# EAGLE design sensor (EAGLE 6.5.0)
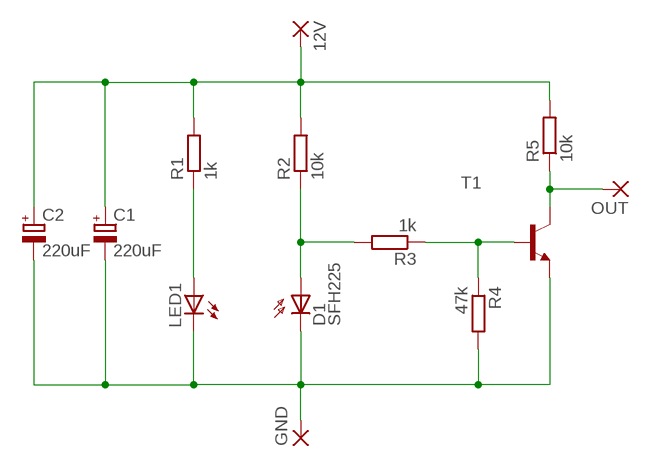
[diagram p0: schematic, sheet 1]

## Parts
12V  SMD2  [SMD1,27-2,54]
C1  220uF  CPOL-EUE5-6  [E5-6]
C2  220uF  CPOL-EUE5-6  [E5-6]
D1  SFH225  [SFH225]
GND  SMD2  [SMD1,27-2,54]
LED1  LED3MM  [LED3MM]
OUT  SMD2  [SMD1,27-2,54]
R1  1k  R-EU_M0805  [M0805]
R2  10k  R-EU_M0805  [M0805]
R3  1k  R-EU_M0805  [M0805]
R4  47k  R-EU_M0805  [M0805]
R5  10k  R-EU_M0805  [M0805]
T1  -NPN-SOT23-EBC  [SOT23-EBC]

## Nets
N$1: C1.- C2.- D1.K(C) GND.1(P) LED1.K(C) R4.2 T1.E
N$2: D1.A R2.1 R3.2
N$3: LED1.A R1.1
N$4: 12V.1(P) C1.+ C2.+ R1.2 R2.2 R5.2
N$6: R3.1 R4.1 T1.B
N$30: OUT.1(P) R5.1 T1.C

## Library data of the parts
12V GND OUT = wirepad:SMD2: SMD PAD
C1 C2 = resistor:CPOL-EU: POLARIZED CAPACITOR, European symbol
D1 = opto-trans-siemens:SFH225: PHOTO DIODE; OC_FARNELL: unknown; OC_NEWARK: unknown
LED1 = sparkfun-LED:LED: LEDs Standard schematic elements and footprints for 5mm, 3mm, 1206, and 0603 sized LEDs. 5mm - Spark Fun Electronics SKU : COM-00529 (and others)
R1-R5 = rcl:R-EU_: RESISTOR, European symbol
T1 = transistor:*-NPN-: NPN Transistror BF959 corrected 2008.03.06

## Board
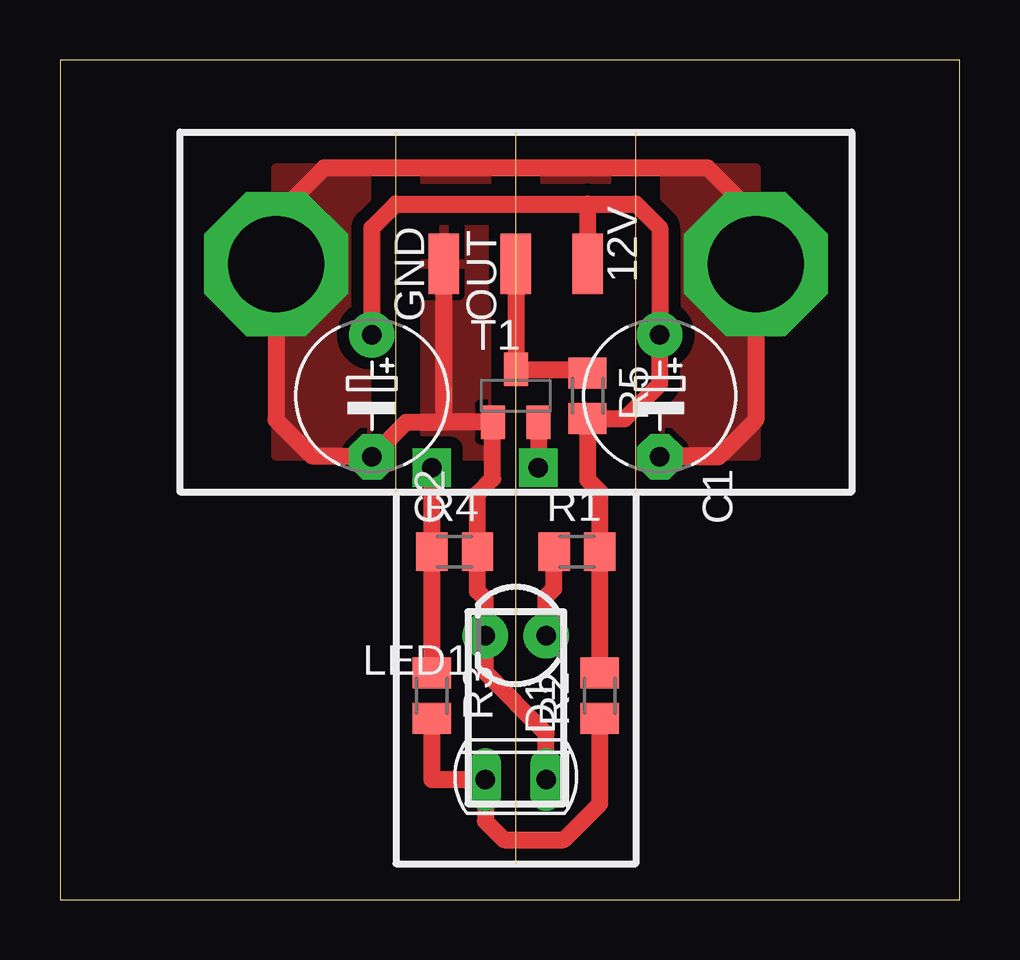
[diagram p1: board, top side]
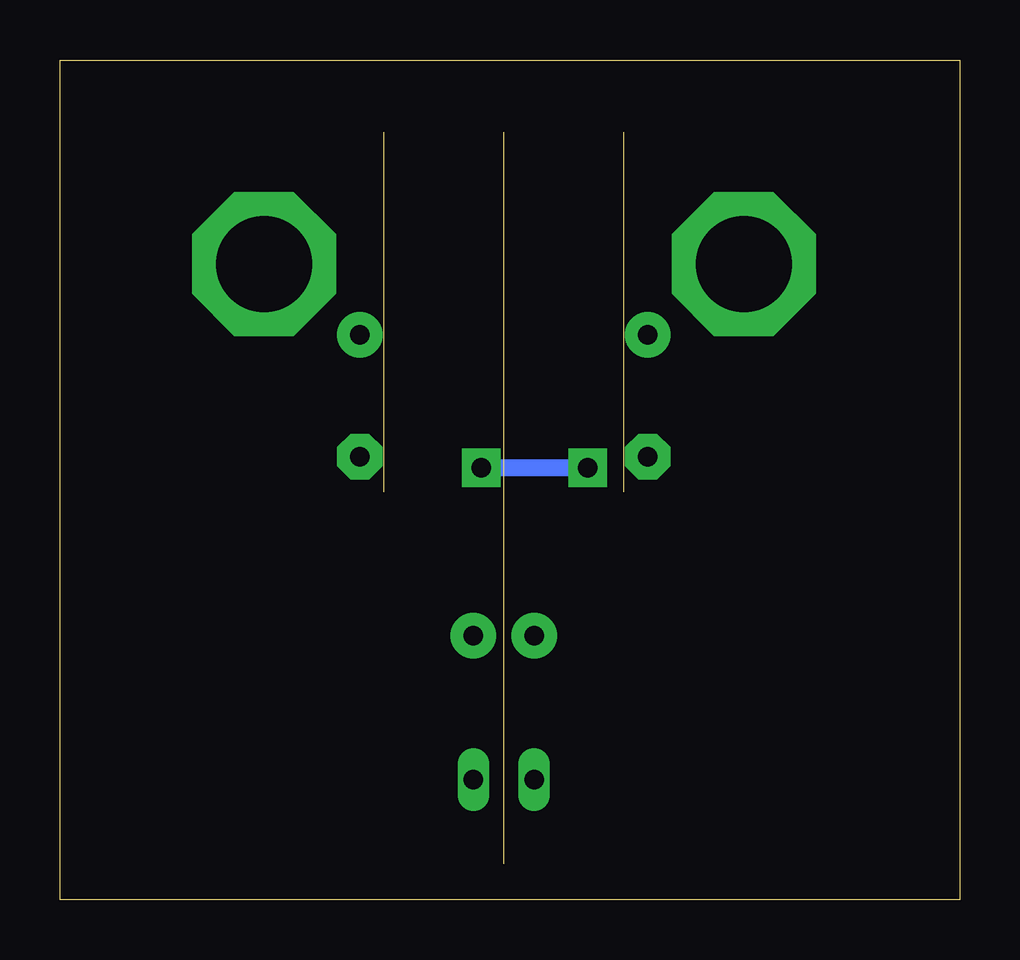
[diagram p2: board, bottom side, seen from below]

Size 37.5 x 35 mm. Coordinates in mm from the lower left corner, seen from the top.
Outline: 19,1.5 19,32
Outline: 14,17 14,32
Outline: 24,17 24,32
Outline: 0,0 37.5,0 37.5,35 0,35 0,0
Copper layers (1*16): Top 0.035mm / dielectric 1.5mm / Bottom 0.035mm
Design rules "default": minimum track width 10mil, minimum drill 24mil, track to track 8mil, track to pad 8mil, pad to pad 8mil, via to via 8mil, smd to smd 8mil, copper to edge 40mil, drill to drill 8mil, minimum pad ring 10mil, minimum via ring 8mil, stop-mask expansion 4mil, vias tented up to drill 0mil, thermal gap 10mil

### Footprints (pad centres in the part's own frame; a part is rotated, then mirrored left to right if it is on the bottom)
SMD1,27-2,54 = smd 1.27 x 2.54: 1 0,0
E5-6 = drill 0.813 pad 1.905: + -2.54,0 | drill 0.813 pad 1.905 octagon: - 2.54,0
SFH225 = drill 0.813 long: A 0,1.27; K 0,-1.27
LED3MM = drill 0.813 pad 1.88: A -1.27,0; K 1.27,0
M0805 = smd 1.3 x 1.6: 1 -0.95,0; 2 0.95,0
SOT23-EBC = smd 1 x 1.4: B 0.95,-1.1; C 0,1.1; E -0.95,-1.1

### Placement (x,y rotation side)
12V  22,26.5 180 top
C1  25,21 270 top
C2  13,21 270 top
D1  19,5 90 top
GND  16,26.5 0 top
LED1  19,11 180 top
OUT  19,26.5 0 top
R1  21.55,14.5 0 top
R2  22.5,8.5 90 top
R3  15.5,8.5 270 top
R4  16.45,14.5 0 top
R5  21.99,21 270 top
T1  19,21 0 top

### Tracks (layer width: path | path; a pad name or v marks a point on that pad's centre or on a via)
N$1  (via drill 4 pad 6)
  Top 0.7: D1.K 20.27,6.93 17.73,9.47 LED1.K 17.73,12.53 17.4,12.86 R4.2 17.4,16.91 18.04,17.55 T1.E 15.9,19.9 | 15.9,19.9 14.44,19.9 C2.- 12.96,18.5 10.5,18.5 9,20 v9,26.5 9,28.5 11,30.5 27,30.5 29,28.5 v29,26.5 29,20 27.5,18.5 | 15.9,19.9 16,20 GND.1 | 27.5,18.5 25.04,18.5 C1.- 27.46,18.46 27.5,18.5
  pour Top (isolate 0.5): 9,30.5 9,18.5 29,18.5 29,30.5
N$2
  Top 0.7: R3.2 15.5,5 D1.A 17.73,3.27 18.5,2.5 21,2.5 22.5,4 R2.1
N$3
  Top 0.7: LED1.A 20.27,12.64 20.59,12.96 R1.1
N$4
  Top 0.7: R2.2 R1.2 22.5,17 22,17.5 R5.2 23.55,20.05 25,21.5 C1.+ 25,28 24,29 22,29 | C2.+ 13,28 14,29 22,29 | 12V.1 22,29
N$6  (via drill 0.8 pad 1.6)
  Top 0.7: 20.05,20 T1.B v19.95,18.01 v19.94,18 | R3.1 R4.1 v15.5,18
  Bottom 0.7: v15.5,18 v19.94,18
N$30
  Top 0.7: OUT.1 T1.C 21.84,22.1 R5.1